# EAGLE schematic JugendLichtSteuerung (EAGLE 7.2.0)
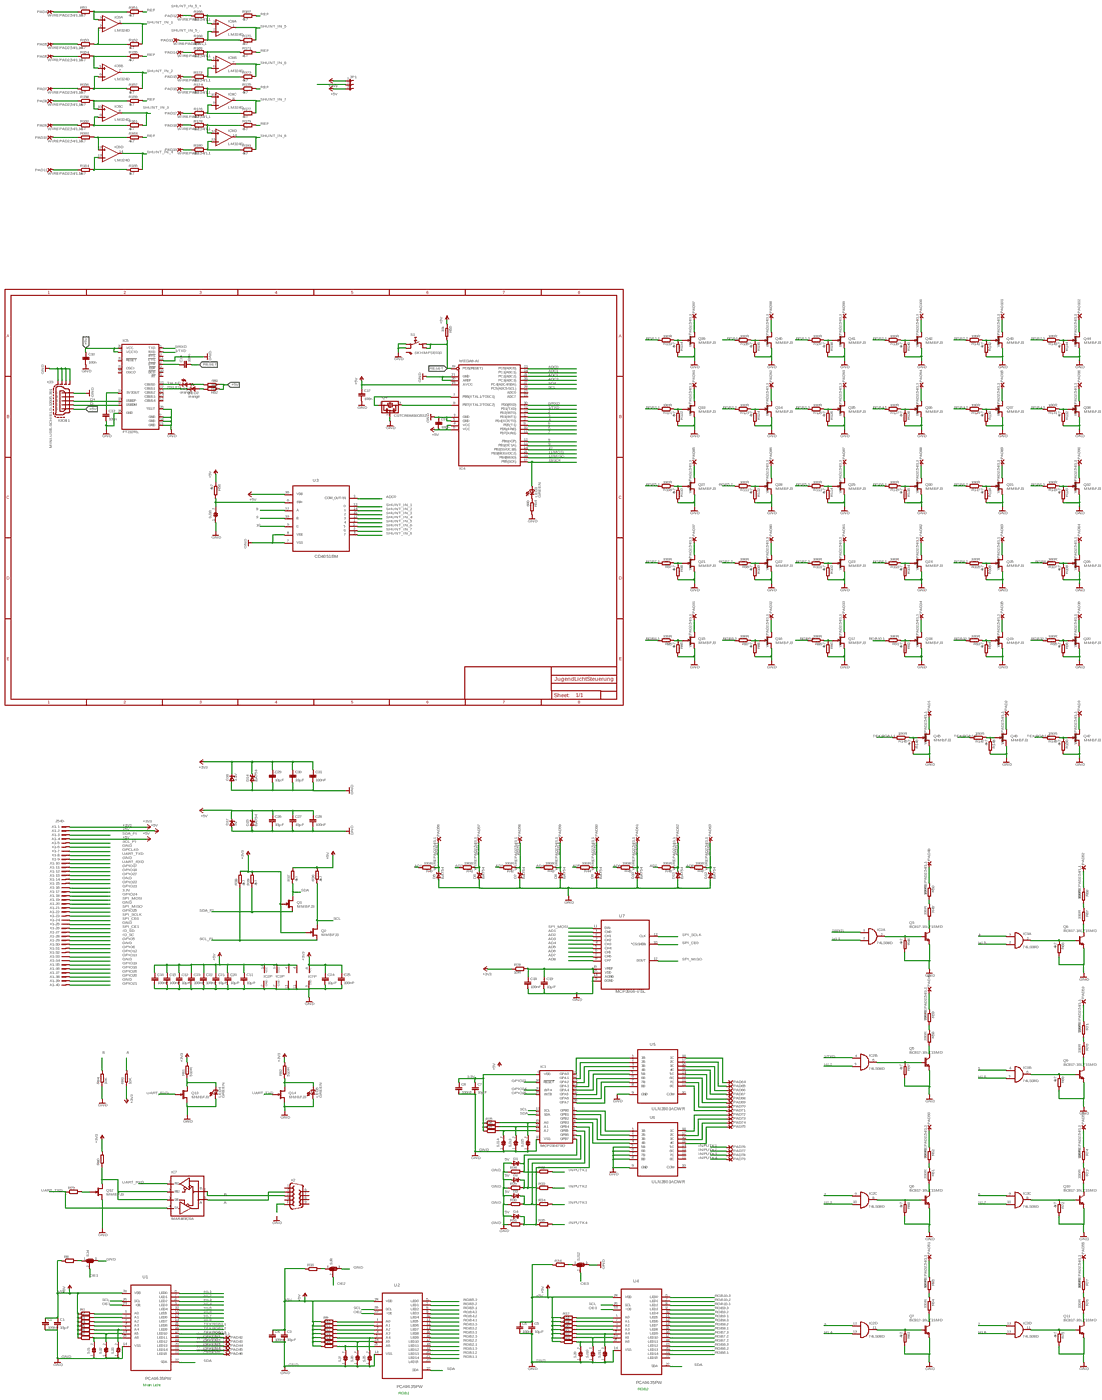
[diagram p0: schematic, sheet 1, overview]
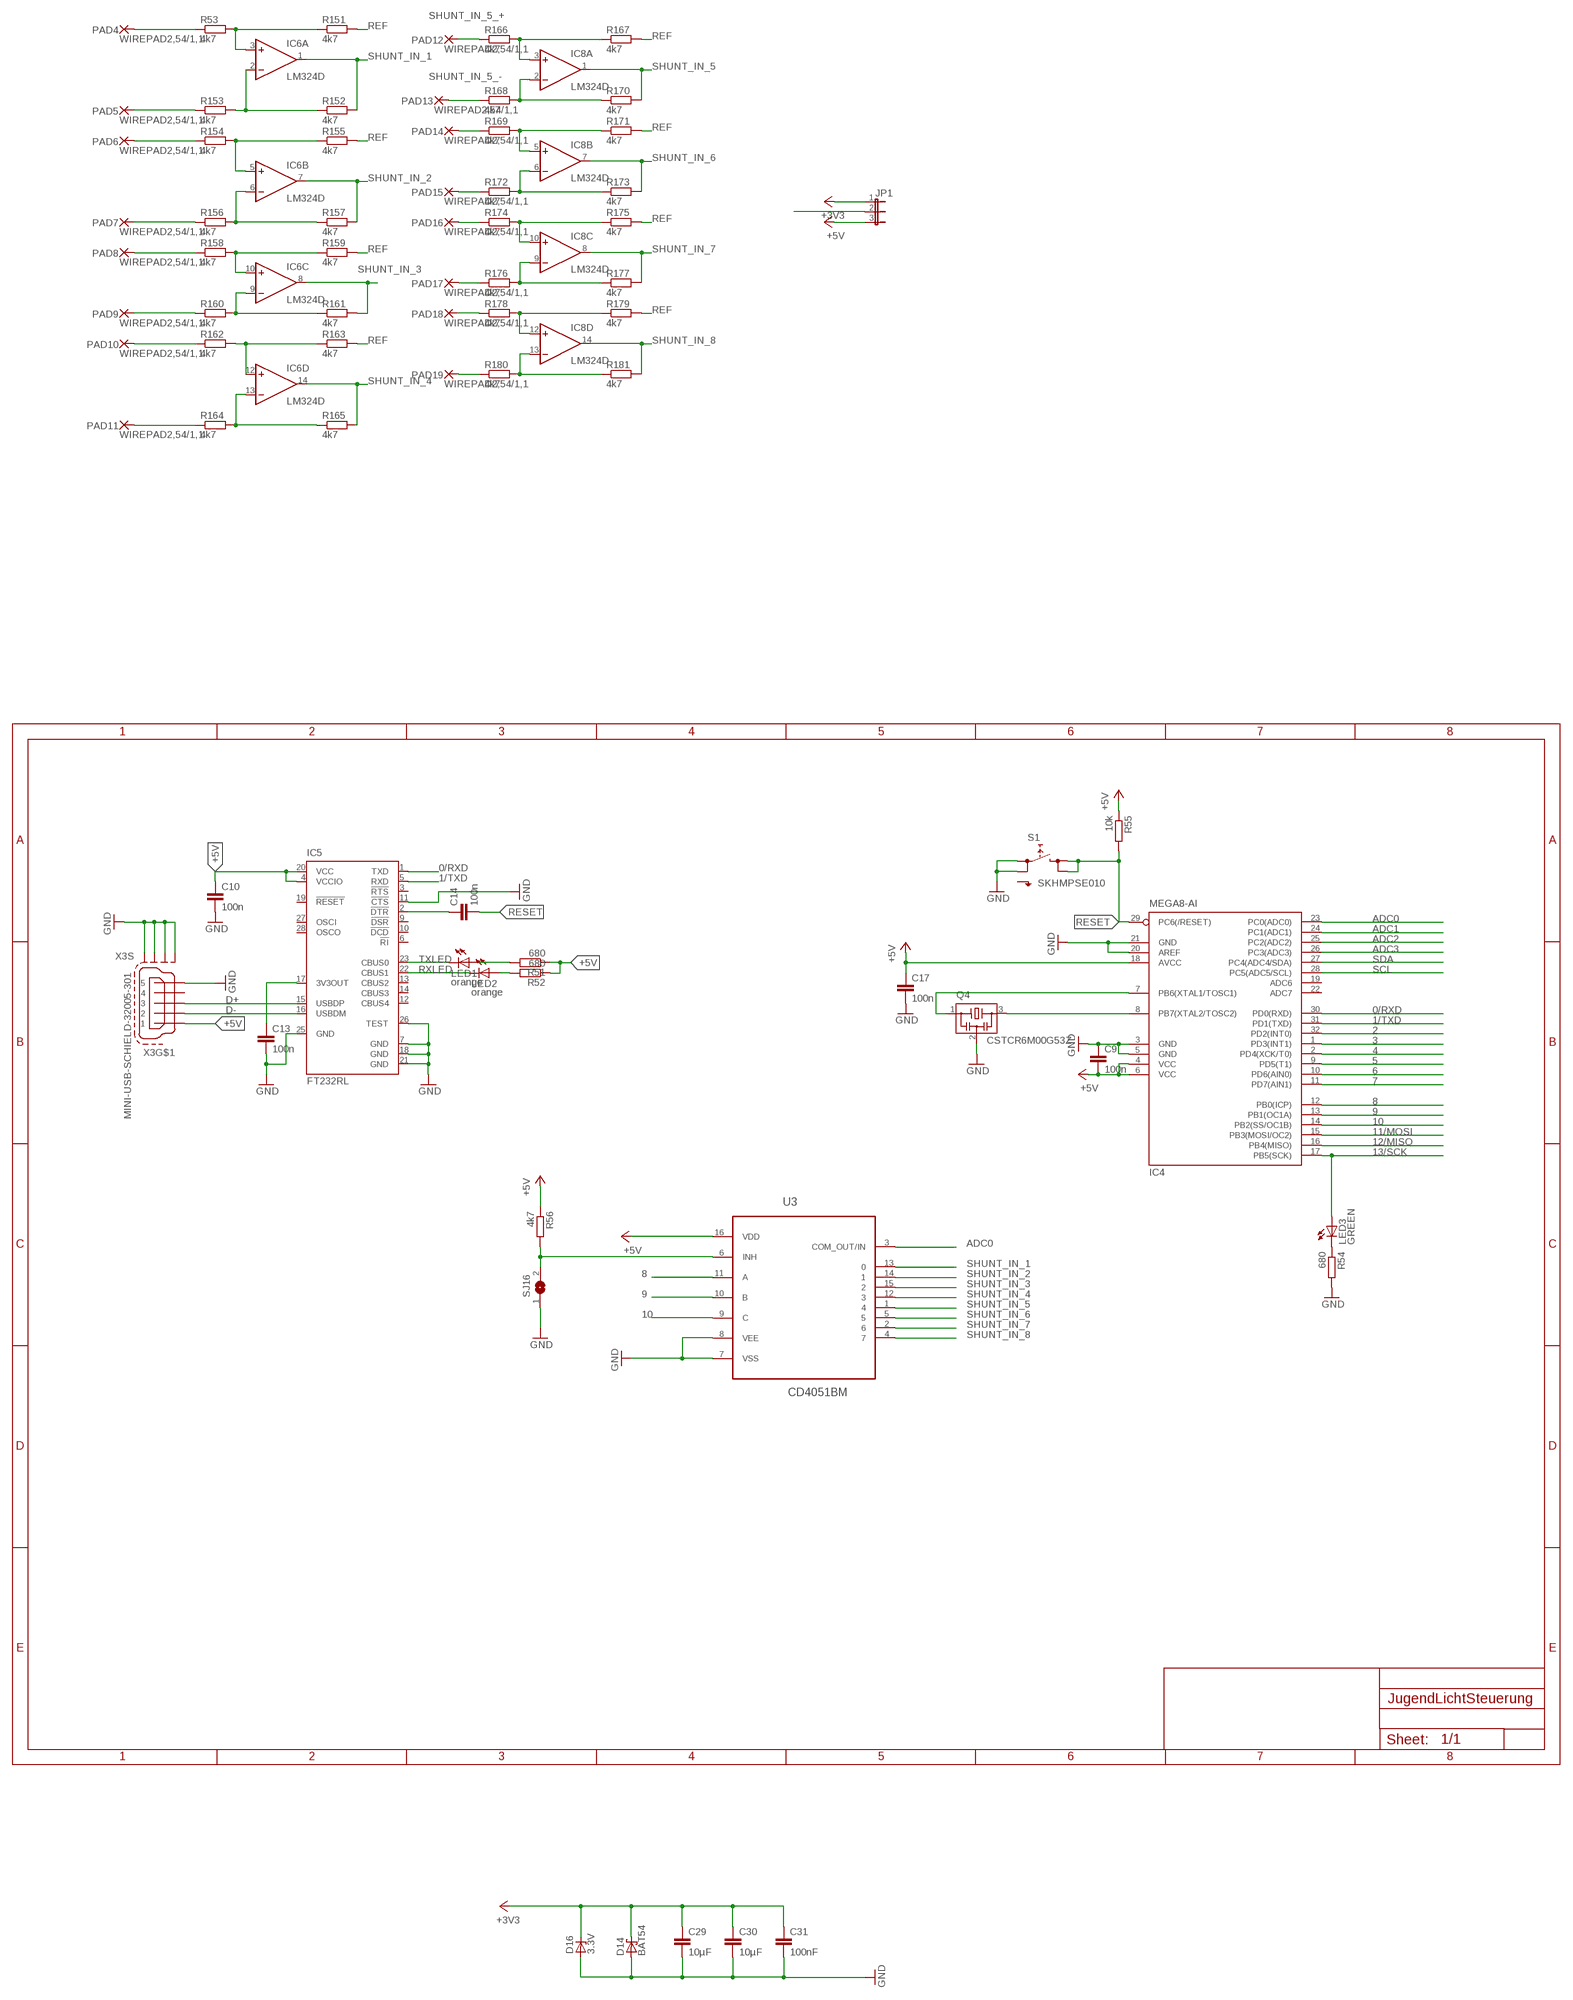
[diagram p1: schematic, sheet 1, part 1 of 4]
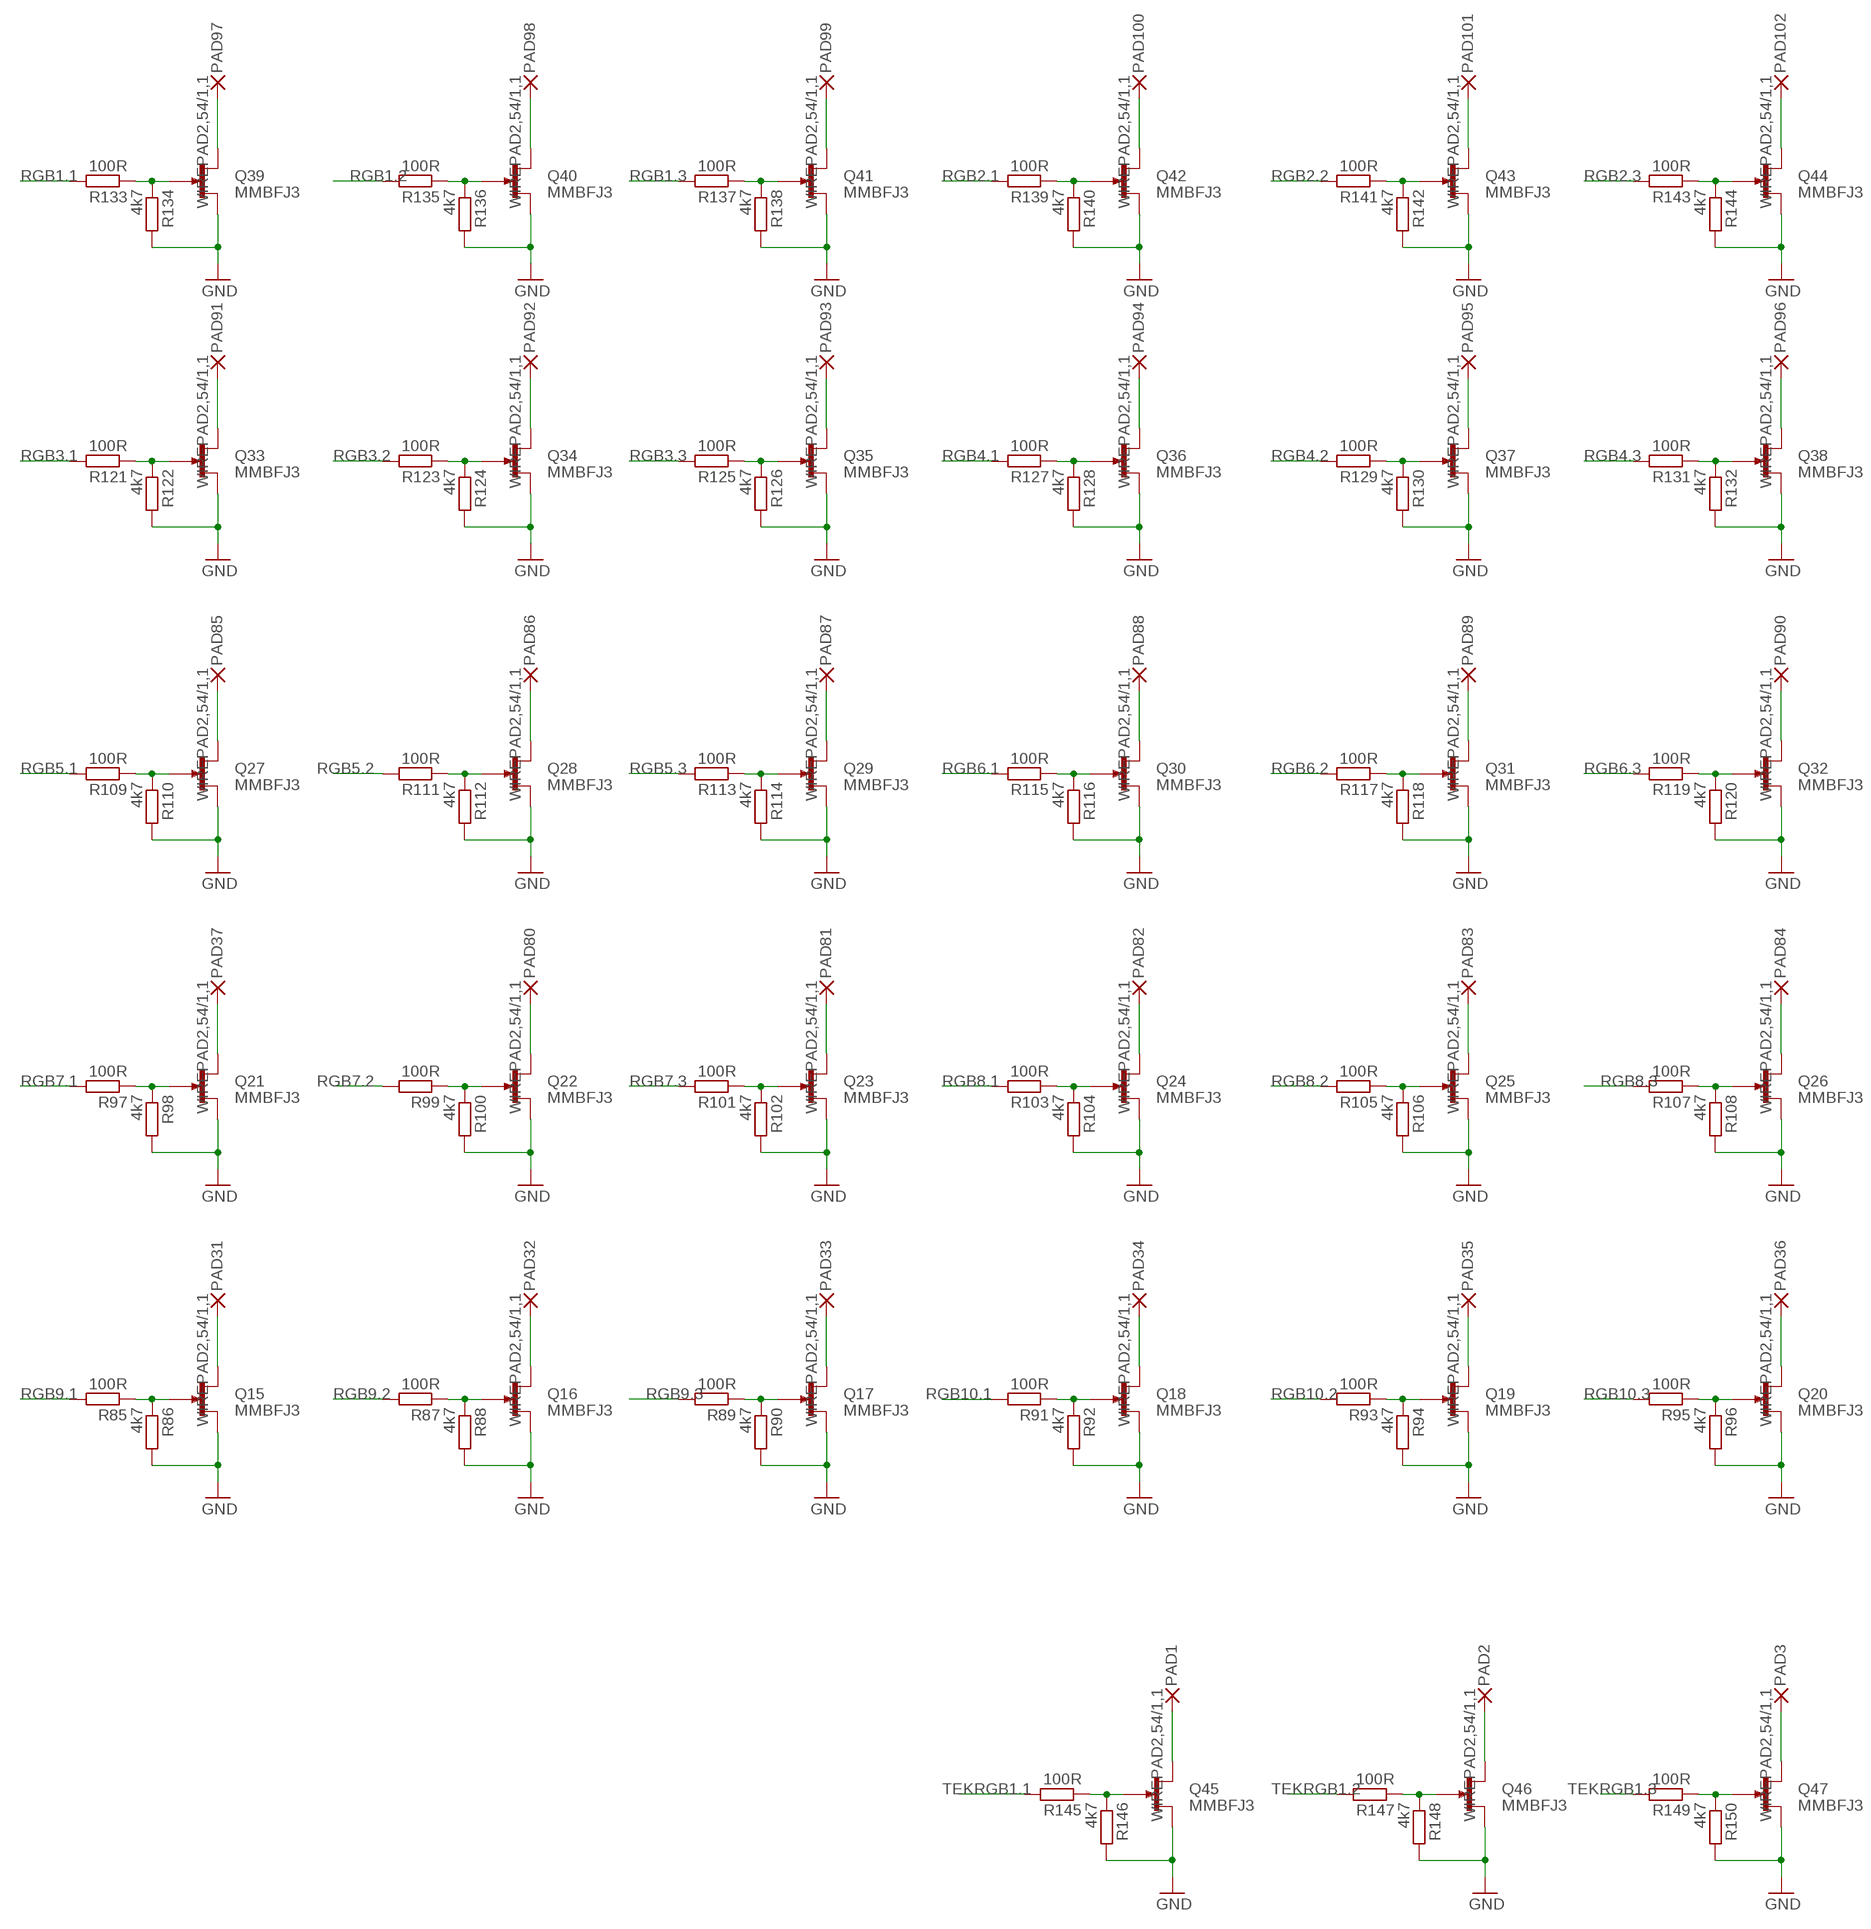
[diagram p2: schematic, sheet 1, part 2 of 4]
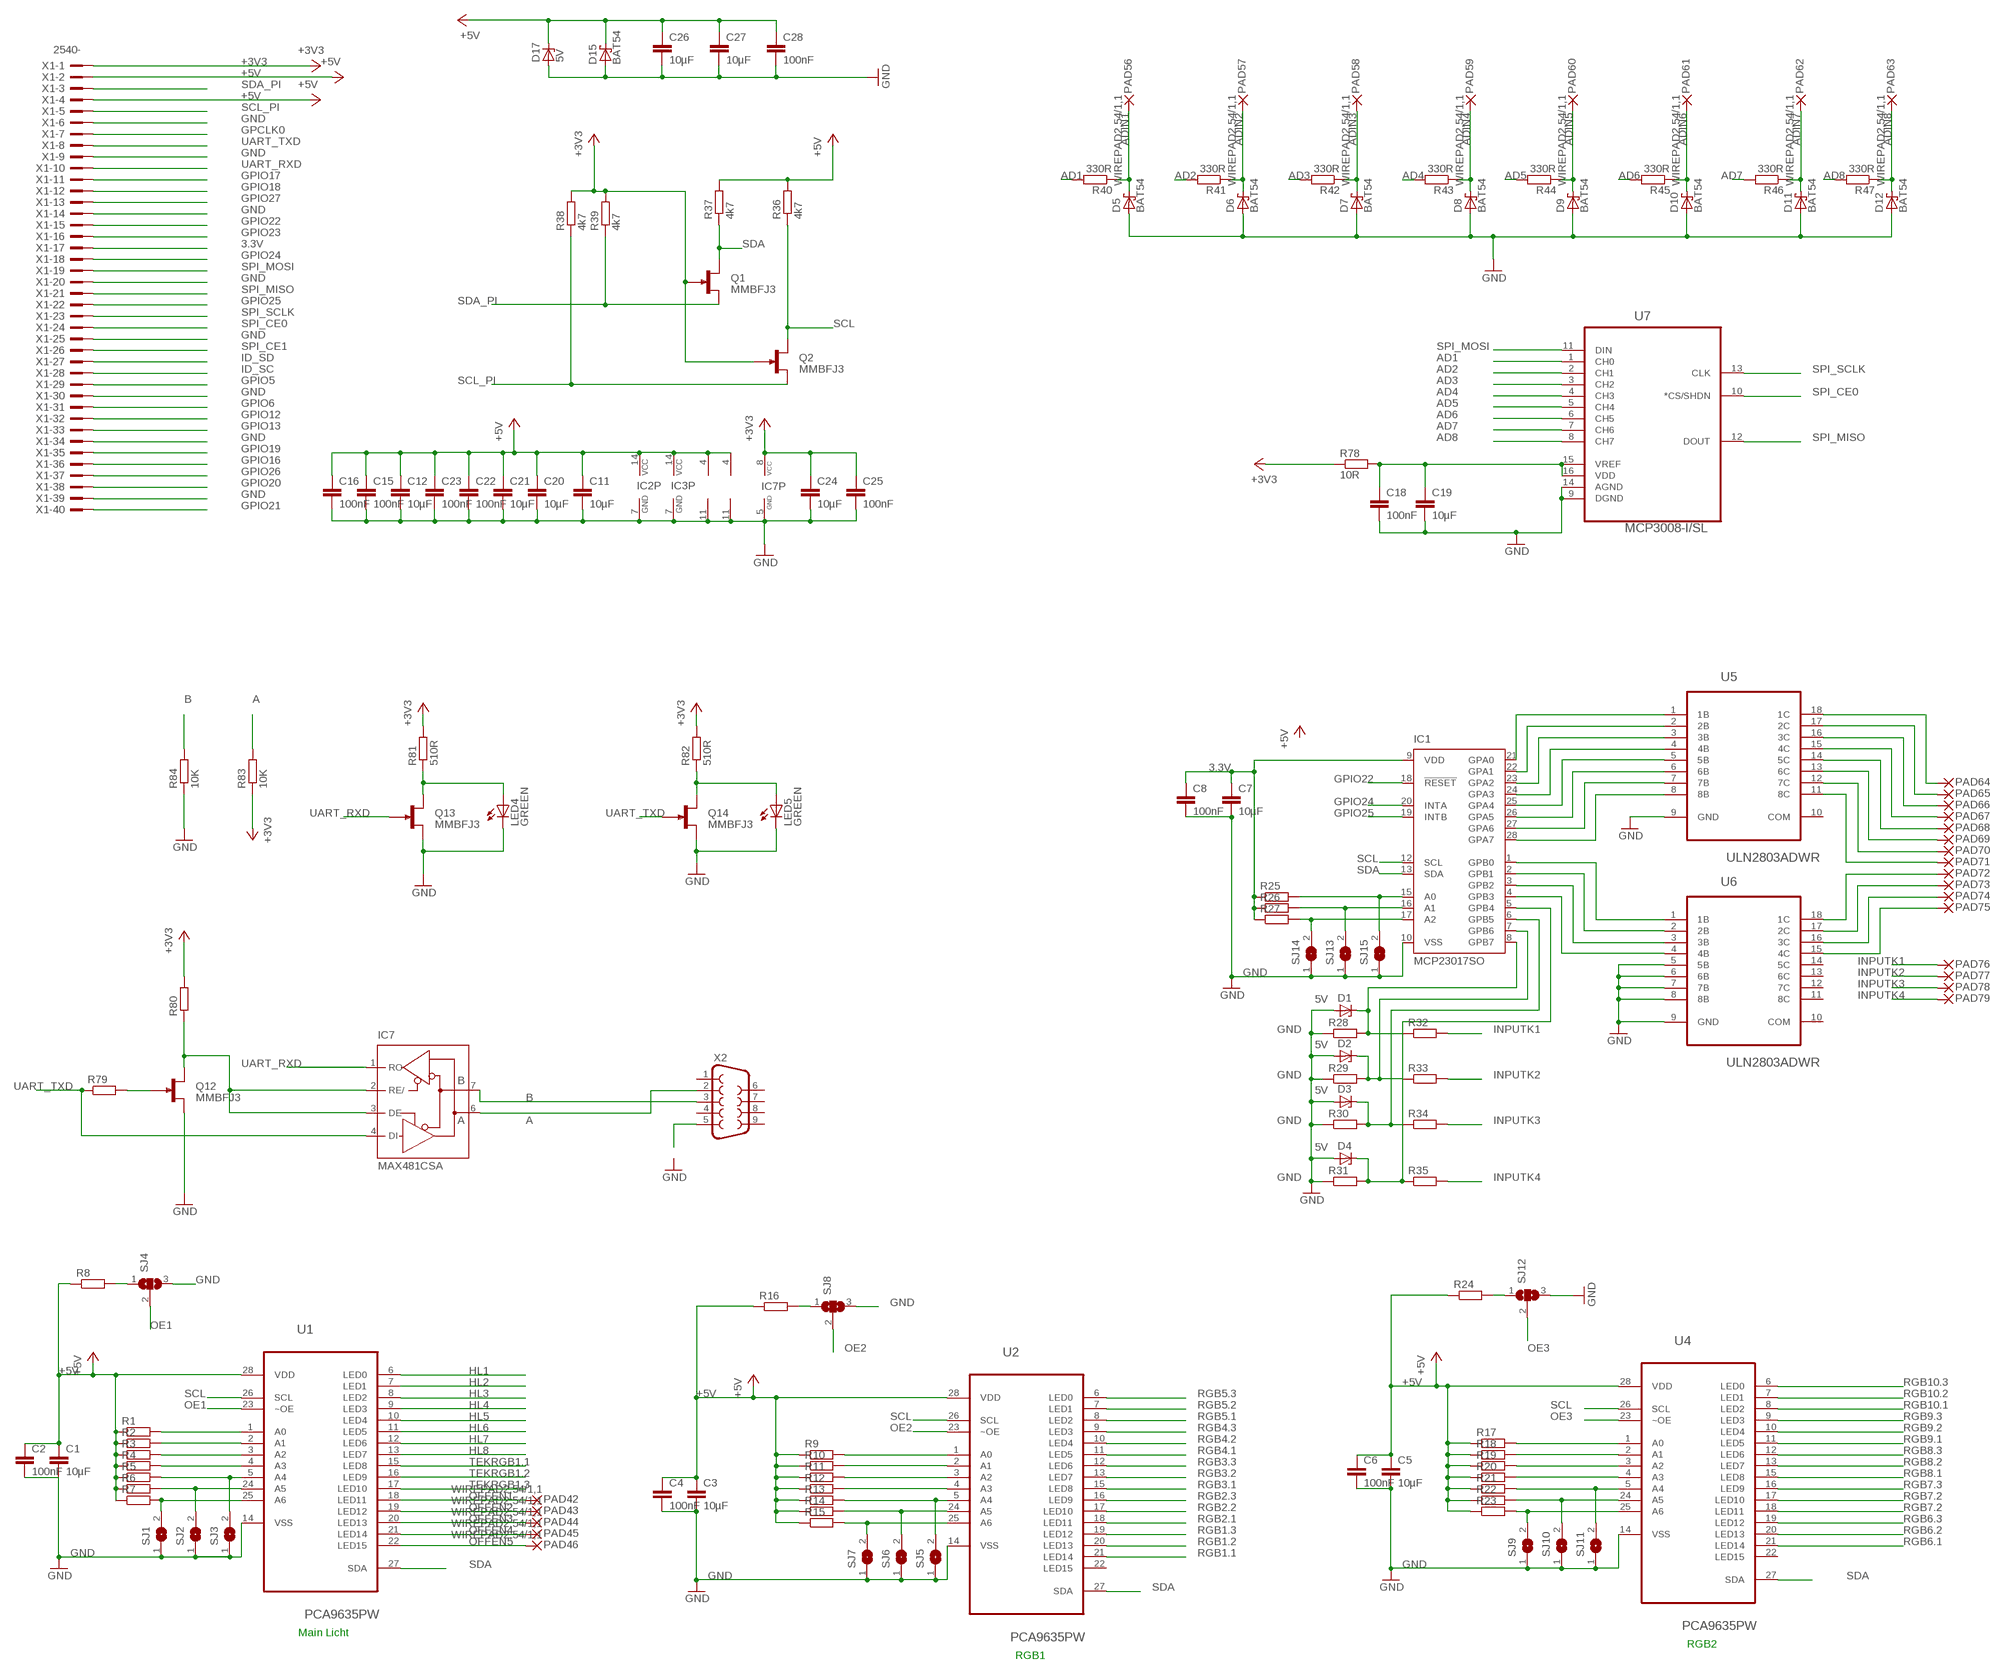
[diagram p3: schematic, sheet 1, part 3 of 4]
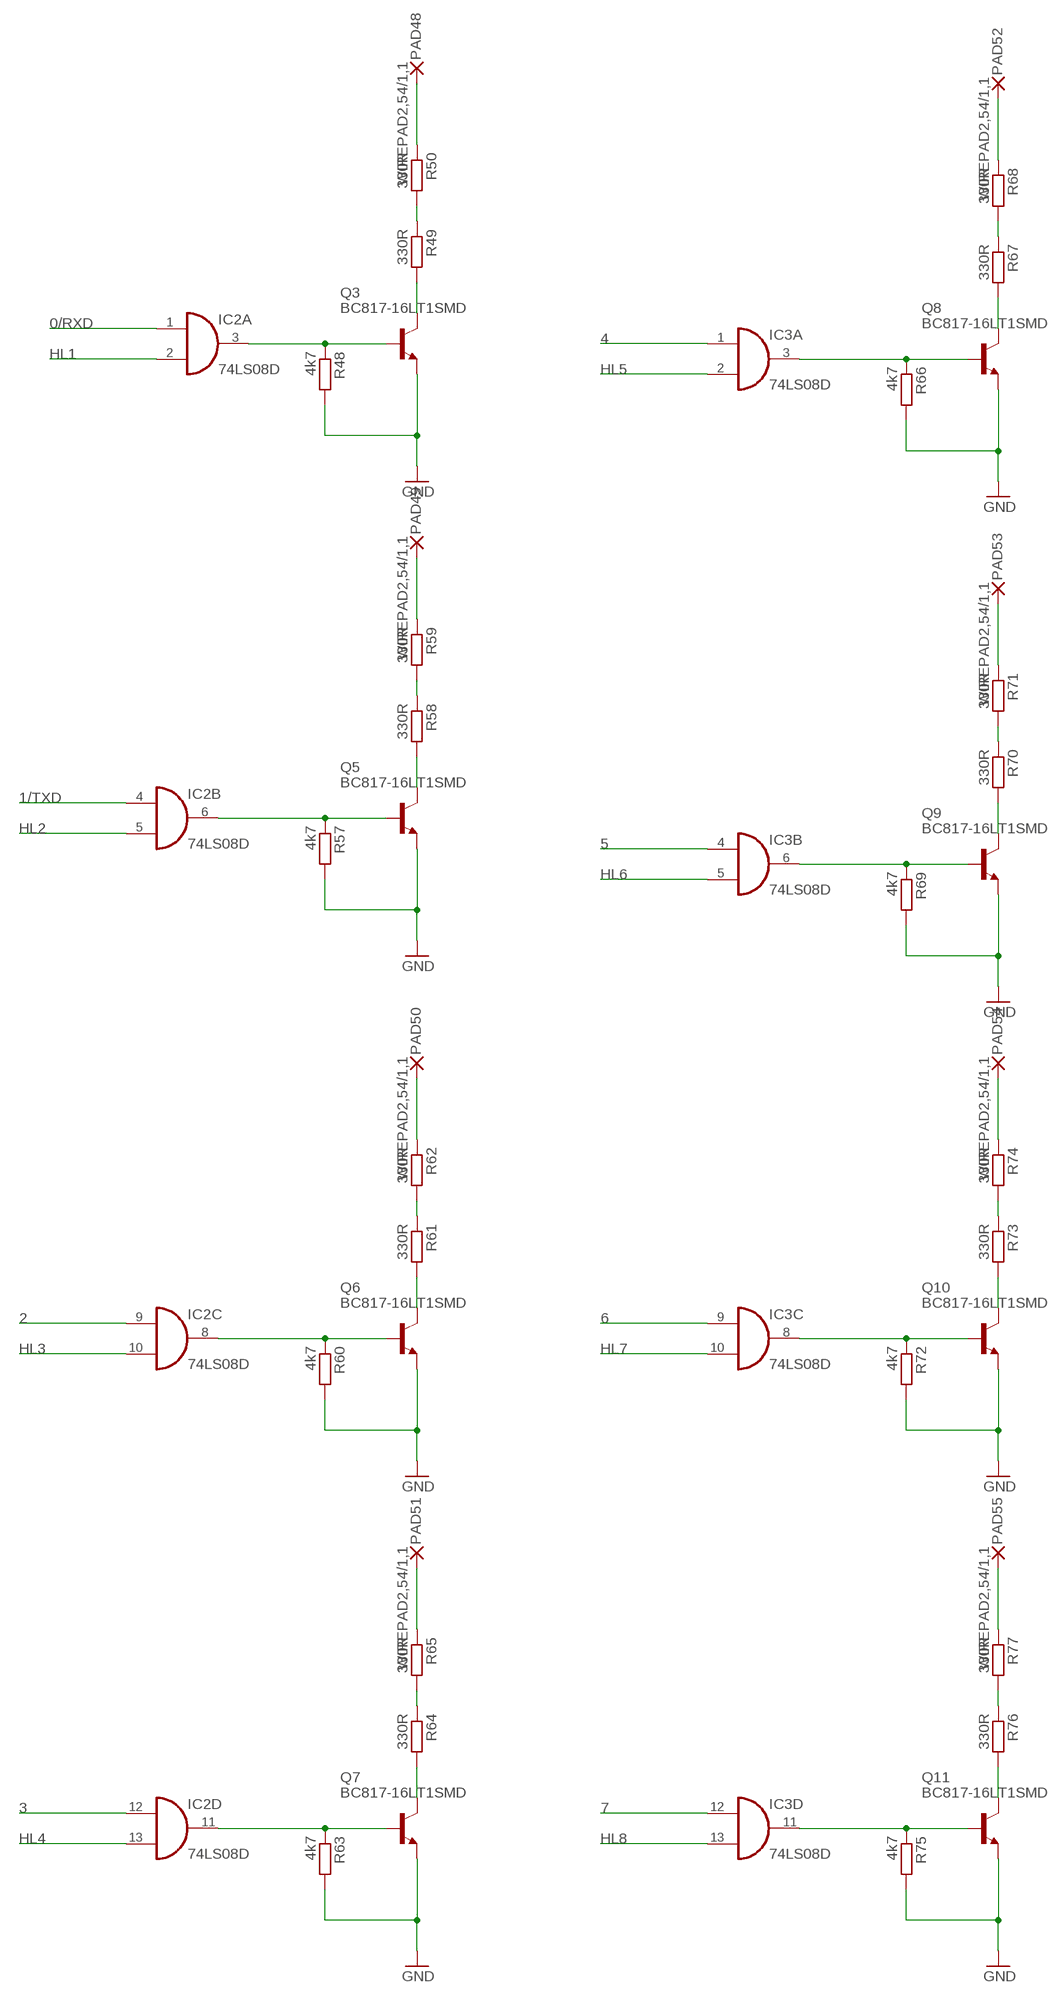
[diagram p4: schematic, sheet 1, part 4 of 4]

## Parts
C1  10µF  C-EUC0805  [C0805]
C2  100nF  C-EUC0805  [C0805]
C3  10µF  C-EUC0805  [C0805]
C4  100nF  C-EUC0805  [C0805]
C5  10µF  C-EUC0805  [C0805]
C6  100nF  C-EUC0805  [C0805]
C7  10µF  C-EUC0805  [C0805]
C8  100nF  C-EUC0805  [C0805]
C9  100n  C-EUC0603  [C0603]
C10  100n  C-EUC0603  [C0603]
C11  10µF  C-EUC0805  [C0805]
C12  10µF  C-EUC0805  [C0805]
C13  100n  C-EUC1206K  [C1206K]
C14  100n  C-EUC0603  [C0603]
C15  100nF  C-EUC0805  [C0805]
C16  100nF  C-EUC0805  [C0805]
C17  100n  C-EUC0603K  [C0603K]
C18  100nF  C-EUC0805  [C0805]
C19  10µF  C-EUC0805  [C0805]
C20  10µF  C-EUC0805  [C0805]
C21  10µF  C-EUC0805  [C0805]
C22  100nF  C-EUC0805  [C0805]
C23  100nF  C-EUC0805  [C0805]
C24  10µF  C-EUC0805  [C0805]
C25  100nF  C-EUC0805  [C0805]
C26  10µF  C-EUC0805  [C0805]
C27  10µF  C-EUC0805  [C0805]
C28  100nF  C-EUC0805  [C0805]
C29  10µF  C-EUC0805  [C0805]
C30  10µF  C-EUC0805  [C0805]
C31  100nF  C-EUC0805  [C0805]
D1  5V  ZENER-DIODESOD80C  [SOD80C]
D2  5V  ZENER-DIODESOD80C  [SOD80C]
D3  5V  ZENER-DIODESOD80C  [SOD80C]
D4  5V  ZENER-DIODESOD80C  [SOD80C]
D5  BAT54  [SOT23]
D6  BAT54  [SOT23]
D7  BAT54  [SOT23]
D8  BAT54  [SOT23]
D9  BAT54  [SOT23]
D10  BAT54  [SOT23]
D11  BAT54  [SOT23]
D12  BAT54  [SOT23]
D14  BAT54  [SOT23]
D15  BAT54  [SOT23]
D16  3.3V  ZENER-DIODESOD80C  [SOD80C]
D17  5V  ZENER-DIODESOD80C  [SOD80C]
IC1  MCP23017SO  [SO28W]
IC2  74LS08D  [SO14]
IC3  74LS08D  [SO14]
IC4  MEGA8-AI  [TQFP32-08]
IC5  FT232RL  [SSOP28]
IC6  LM324D  [SO14]
IC7  MAX481CSA  [SO08]
IC8  LM324D  [SO14]
JP1  JP2E  [JP2]
LED1  orange  LEDCHIPLED_1206  [CHIPLED_1206]
LED2  orange  LEDCHIPLED_1206  [CHIPLED_1206]
LED3  GREEN  LEDCHIPLED_1206  [CHIPLED_1206]
LED4  GREEN  LEDCHIPLED_1206  [CHIPLED_1206]
LED5  GREEN  LEDCHIPLED_1206  [CHIPLED_1206]
PAD1  WIREPAD2,54/1,1  [2,54/1,1]
PAD2  WIREPAD2,54/1,1  [2,54/1,1]
PAD3  WIREPAD2,54/1,1  [2,54/1,1]
PAD4  WIREPAD2,54/1,1  [2,54/1,1]
PAD5  WIREPAD2,54/1,1  [2,54/1,1]
PAD6  WIREPAD2,54/1,1  [2,54/1,1]
PAD7  WIREPAD2,54/1,1  [2,54/1,1]
PAD8  WIREPAD2,54/1,1  [2,54/1,1]
PAD9  WIREPAD2,54/1,1  [2,54/1,1]
PAD10  WIREPAD2,54/1,1  [2,54/1,1]
PAD11  WIREPAD2,54/1,1  [2,54/1,1]
PAD12  WIREPAD2,54/1,1  [2,54/1,1]
PAD13  WIREPAD2,54/1,1  [2,54/1,1]
PAD14  WIREPAD2,54/1,1  [2,54/1,1]
PAD15  WIREPAD2,54/1,1  [2,54/1,1]
PAD16  WIREPAD2,54/1,1  [2,54/1,1]
PAD17  WIREPAD2,54/1,1  [2,54/1,1]
PAD18  WIREPAD2,54/1,1  [2,54/1,1]
PAD19  WIREPAD2,54/1,1  [2,54/1,1]
PAD31  WIREPAD2,54/1,1  [2,54/1,1]
PAD32  WIREPAD2,54/1,1  [2,54/1,1]
PAD33  WIREPAD2,54/1,1  [2,54/1,1]
PAD34  WIREPAD2,54/1,1  [2,54/1,1]
PAD35  WIREPAD2,54/1,1  [2,54/1,1]
PAD36  WIREPAD2,54/1,1  [2,54/1,1]
PAD37  WIREPAD2,54/1,1  [2,54/1,1]
PAD42  WIREPAD2,54/1,1  [2,54/1,1]
PAD43  WIREPAD2,54/1,1  [2,54/1,1]
PAD44  WIREPAD2,54/1,1  [2,54/1,1]
PAD45  WIREPAD2,54/1,1  [2,54/1,1]
PAD46  WIREPAD2,54/1,1  [2,54/1,1]
PAD48  WIREPAD2,54/1,1  [2,54/1,1]
PAD49  WIREPAD2,54/1,1  [2,54/1,1]
PAD50  WIREPAD2,54/1,1  [2,54/1,1]
PAD51  WIREPAD2,54/1,1  [2,54/1,1]
PAD52  WIREPAD2,54/1,1  [2,54/1,1]
PAD53  WIREPAD2,54/1,1  [2,54/1,1]
PAD54  WIREPAD2,54/1,1  [2,54/1,1]
PAD55  WIREPAD2,54/1,1  [2,54/1,1]
PAD56  WIREPAD2,54/1,1  [2,54/1,1]
PAD57  WIREPAD2,54/1,1  [2,54/1,1]
PAD58  WIREPAD2,54/1,1  [2,54/1,1]
PAD59  WIREPAD2,54/1,1  [2,54/1,1]
PAD60  WIREPAD2,54/1,1  [2,54/1,1]
PAD61  WIREPAD2,54/1,1  [2,54/1,1]
PAD62  WIREPAD2,54/1,1  [2,54/1,1]
PAD63  WIREPAD2,54/1,1  [2,54/1,1]
PAD64  3,81/1,4  [3,81/1,4]
PAD65  3,81/1,4  [3,81/1,4]
PAD66  3,81/1,4  [3,81/1,4]
PAD67  3,81/1,4  [3,81/1,4]
PAD68  3,81/1,4  [3,81/1,4]
PAD69  3,81/1,4  [3,81/1,4]
PAD70  3,81/1,4  [3,81/1,4]
PAD71  3,81/1,4  [3,81/1,4]
PAD72  3,81/1,4  [3,81/1,4]
PAD73  3,81/1,4  [3,81/1,4]
PAD74  3,81/1,4  [3,81/1,4]
PAD75  3,81/1,4  [3,81/1,4]
PAD76  3,81/1,4  [3,81/1,4]
PAD77  3,81/1,4  [3,81/1,4]
PAD78  3,81/1,4  [3,81/1,4]
PAD79  3,81/1,4  [3,81/1,4]
PAD80  WIREPAD2,54/1,1  [2,54/1,1]
PAD81  WIREPAD2,54/1,1  [2,54/1,1]
PAD82  WIREPAD2,54/1,1  [2,54/1,1]
PAD83  WIREPAD2,54/1,1  [2,54/1,1]
PAD84  WIREPAD2,54/1,1  [2,54/1,1]
PAD85  WIREPAD2,54/1,1  [2,54/1,1]
PAD86  WIREPAD2,54/1,1  [2,54/1,1]
PAD87  WIREPAD2,54/1,1  [2,54/1,1]
PAD88  WIREPAD2,54/1,1  [2,54/1,1]
PAD89  WIREPAD2,54/1,1  [2,54/1,1]
PAD90  WIREPAD2,54/1,1  [2,54/1,1]
PAD91  WIREPAD2,54/1,1  [2,54/1,1]
PAD92  WIREPAD2,54/1,1  [2,54/1,1]
PAD93  WIREPAD2,54/1,1  [2,54/1,1]
PAD94  WIREPAD2,54/1,1  [2,54/1,1]
PAD95  WIREPAD2,54/1,1  [2,54/1,1]
PAD96  WIREPAD2,54/1,1  [2,54/1,1]
PAD97  WIREPAD2,54/1,1  [2,54/1,1]
PAD98  WIREPAD2,54/1,1  [2,54/1,1]
PAD99  WIREPAD2,54/1,1  [2,54/1,1]
PAD100  WIREPAD2,54/1,1  [2,54/1,1]
PAD101  WIREPAD2,54/1,1  [2,54/1,1]
PAD102  WIREPAD2,54/1,1  [2,54/1,1]
Q1  MMBFJ3  [SOT23]
Q2  MMBFJ3  [SOT23]
Q3  BC817-16LT1SMD  [SOT23-BEC]
Q4  CSTCR6M00G53Z  [CSTCR6M]
Q5  BC817-16LT1SMD  [SOT23-BEC]
Q6  BC817-16LT1SMD  [SOT23-BEC]
Q7  BC817-16LT1SMD  [SOT23-BEC]
Q8  BC817-16LT1SMD  [SOT23-BEC]
Q9  BC817-16LT1SMD  [SOT23-BEC]
Q10  BC817-16LT1SMD  [SOT23-BEC]
Q11  BC817-16LT1SMD  [SOT23-BEC]
Q12  MMBFJ3  [SOT23]
Q13  MMBFJ3  [SOT23]
Q14  MMBFJ3  [SOT23]
Q15  MMBFJ3  [SOT23]
Q16  MMBFJ3  [SOT23]
Q17  MMBFJ3  [SOT23]
Q18  MMBFJ3  [SOT23]
Q19  MMBFJ3  [SOT23]
Q20  MMBFJ3  [SOT23]
Q21  MMBFJ3  [SOT23]
Q22  MMBFJ3  [SOT23]
Q23  MMBFJ3  [SOT23]
Q24  MMBFJ3  [SOT23]
Q25  MMBFJ3  [SOT23]
Q26  MMBFJ3  [SOT23]
Q27  MMBFJ3  [SOT23]
Q28  MMBFJ3  [SOT23]
Q29  MMBFJ3  [SOT23]
Q30  MMBFJ3  [SOT23]
Q31  MMBFJ3  [SOT23]
Q32  MMBFJ3  [SOT23]
Q33  MMBFJ3  [SOT23]
Q34  MMBFJ3  [SOT23]
Q35  MMBFJ3  [SOT23]
Q36  MMBFJ3  [SOT23]
Q37  MMBFJ3  [SOT23]
Q38  MMBFJ3  [SOT23]
Q39  MMBFJ3  [SOT23]
Q40  MMBFJ3  [SOT23]
Q41  MMBFJ3  [SOT23]
Q42  MMBFJ3  [SOT23]
Q43  MMBFJ3  [SOT23]
Q44  MMBFJ3  [SOT23]
Q45  MMBFJ3  [SOT23]
Q46  MMBFJ3  [SOT23]
Q47  MMBFJ3  [SOT23]
R1  R-EU_R0603  [R0603]
R2  R-EU_R0603  [R0603]
R3  R-EU_R0603  [R0603]
R4  R-EU_R0603  [R0603]
R5  R-EU_R0603  [R0603]
R6  R-EU_R0603  [R0603]
R7  R-EU_R0603  [R0603]
R8  R-EU_R0603  [R0603]
R9  R-EU_R0603  [R0603]
R10  R-EU_R0603  [R0603]
R11  R-EU_R0603  [R0603]
R12  R-EU_R0603  [R0603]
R13  R-EU_R0603  [R0603]
R14  R-EU_R0603  [R0603]
R15  R-EU_R0603  [R0603]
R16  R-EU_R0603  [R0603]
R17  R-EU_R0603  [R0603]
R18  R-EU_R0603  [R0603]
R19  R-EU_R0603  [R0603]
R20  R-EU_R0603  [R0603]
R21  R-EU_R0603  [R0603]
R22  R-EU_R0603  [R0603]
R23  R-EU_R0603  [R0603]
R24  R-EU_R0603  [R0603]
R25  R-EU_R0603  [R0603]
R26  R-EU_R0603  [R0603]
R27  R-EU_R0603  [R0603]
R28  R-EU_R0603  [R0603]
R29  R-EU_R0603  [R0603]
R30  R-EU_R0603  [R0603]
R31  R-EU_R0603  [R0603]
R32  R-EU_R0603  [R0603]
R33  R-EU_R0603  [R0603]
R34  R-EU_R0603  [R0603]
R35  R-EU_R0603  [R0603]
R36  4k7  R-EU_R0603  [R0603]
R37  4k7  R-EU_R0603  [R0603]
R38  4k7  R-EU_R0603  [R0603]
R39  4k7  R-EU_R0603  [R0603]
R40  330R  R-EU_R0603  [R0603]
R41  330R  R-EU_R0603  [R0603]
R42  330R  R-EU_R0603  [R0603]
R43  330R  R-EU_R0603  [R0603]
R44  330R  R-EU_R0603  [R0603]
R45  330R  R-EU_R0603  [R0603]
R46  330R  R-EU_R0603  [R0603]
R47  330R  R-EU_R0603  [R0603]
R48  4k7  R-EU_R0603  [R0603]
R49  330R  R-EU_R0603  [R0603]
R50  330R  R-EU_R0603  [R0603]
R51  680  R-EU_R0603  [R0603]
R52  680  R-EU_R0603  [R0603]
R53  4k7  R-EU_R0603  [R0603]
R54  680  R-EU_R0603  [R0603]
R55  10k  R-EU_R0603  [R0603]
R56  4k7  R-EU_R0603  [R0603]
R57  4k7  R-EU_R0603  [R0603]
R58  330R  R-EU_R0603  [R0603]
R59  330R  R-EU_R0603  [R0603]
R60  4k7  R-EU_R0603  [R0603]
R61  330R  R-EU_R0603  [R0603]
R62  330R  R-EU_R0603  [R0603]
R63  4k7  R-EU_R0603  [R0603]
R64  330R  R-EU_R0603  [R0603]
R65  330R  R-EU_R0603  [R0603]
R66  4k7  R-EU_R0603  [R0603]
R67  330R  R-EU_R0603  [R0603]
R68  330R  R-EU_R0603  [R0603]
R69  4k7  R-EU_R0603  [R0603]
R70  330R  R-EU_R0603  [R0603]
R71  330R  R-EU_R0603  [R0603]
R72  4k7  R-EU_R0603  [R0603]
R73  330R  R-EU_R0603  [R0603]
R74  330R  R-EU_R0603  [R0603]
R75  4k7  R-EU_R0603  [R0603]
R76  330R  R-EU_R0603  [R0603]
R77  330R  R-EU_R0603  [R0603]
R78  10R  R-EU_R0603  [R0603]
R79  R-EU_R0603  [R0603]
R80  R-EU_R0603  [R0603]
R81  510R  R-EU_R0603  [R0603]
R82  510R  R-EU_R0603  [R0603]
R83  10K  R-EU_R0603  [R0603]
R84  10K  R-EU_R0603  [R0603]
R85  100R  R-EU_R0603  [R0603]
R86  4k7  R-EU_R0603  [R0603]
R87  100R  R-EU_R0603  [R0603]
R88  4k7  R-EU_R0603  [R0603]
R89  100R  R-EU_R0603  [R0603]
R90  4k7  R-EU_R0603  [R0603]
R91  100R  R-EU_R0603  [R0603]
R92  4k7  R-EU_R0603  [R0603]
R93  100R  R-EU_R0603  [R0603]
R94  4k7  R-EU_R0603  [R0603]
R95  100R  R-EU_R0603  [R0603]
R96  4k7  R-EU_R0603  [R0603]
R97  100R  R-EU_R0603  [R0603]
R98  4k7  R-EU_R0603  [R0603]
R99  100R  R-EU_R0603  [R0603]
R100  4k7  R-EU_R0603  [R0603]
R101  100R  R-EU_R0603  [R0603]
R102  4k7  R-EU_R0603  [R0603]
R103  100R  R-EU_R0603  [R0603]
R104  4k7  R-EU_R0603  [R0603]
R105  100R  R-EU_R0603  [R0603]
R106  4k7  R-EU_R0603  [R0603]
R107  100R  R-EU_R0603  [R0603]
R108  4k7  R-EU_R0603  [R0603]
R109  100R  R-EU_R0603  [R0603]
R110  4k7  R-EU_R0603  [R0603]
R111  100R  R-EU_R0603  [R0603]
R112  4k7  R-EU_R0603  [R0603]
R113  100R  R-EU_R0603  [R0603]
R114  4k7  R-EU_R0603  [R0603]
R115  100R  R-EU_R0603  [R0603]
R116  4k7  R-EU_R0603  [R0603]
R117  100R  R-EU_R0603  [R0603]
R118  4k7  R-EU_R0603  [R0603]
R119  100R  R-EU_R0603  [R0603]
R120  4k7  R-EU_R0603  [R0603]
R121  100R  R-EU_R0603  [R0603]
R122  4k7  R-EU_R0603  [R0603]
R123  100R  R-EU_R0603  [R0603]
R124  4k7  R-EU_R0603  [R0603]
R125  100R  R-EU_R0603  [R0603]
R126  4k7  R-EU_R0603  [R0603]
R127  100R  R-EU_R0603  [R0603]
R128  4k7  R-EU_R0603  [R0603]
R129  100R  R-EU_R0603  [R0603]
R130  4k7  R-EU_R0603  [R0603]
R131  100R  R-EU_R0603  [R0603]
R132  4k7  R-EU_R0603  [R0603]
R133  100R  R-EU_R0603  [R0603]
R134  4k7  R-EU_R0603  [R0603]
R135  100R  R-EU_R0603  [R0603]
R136  4k7  R-EU_R0603  [R0603]
R137  100R  R-EU_R0603  [R0603]
R138  4k7  R-EU_R0603  [R0603]
R139  100R  R-EU_R0603  [R0603]
R140  4k7  R-EU_R0603  [R0603]
R141  100R  R-EU_R0603  [R0603]
R142  4k7  R-EU_R0603  [R0603]
R143  100R  R-EU_R0603  [R0603]
R144  4k7  R-EU_R0603  [R0603]
R145  100R  R-EU_R0603  [R0603]
R146  4k7  R-EU_R0603  [R0603]
R147  100R  R-EU_R0603  [R0603]
R148  4k7  R-EU_R0603  [R0603]
R149  100R  R-EU_R0603  [R0603]
R150  4k7  R-EU_R0603  [R0603]
R151  4k7  R-EU_R0603  [R0603]
R152  4k7  R-EU_R0603  [R0603]
R153  4k7  R-EU_R0603  [R0603]
R154  4k7  R-EU_R0603  [R0603]
R155  4k7  R-EU_R0603  [R0603]
R156  4k7  R-EU_R0603  [R0603]
R157  4k7  R-EU_R0603  [R0603]
R158  4k7  R-EU_R0603  [R0603]
R159  4k7  R-EU_R0603  [R0603]
R160  4k7  R-EU_R0603  [R0603]
R161  4k7  R-EU_R0603  [R0603]
R162  4k7  R-EU_R0603  [R0603]
R163  4k7  R-EU_R0805  [R0805]
R164  4k7  R-EU_R0603  [R0603]
R165  4k7  R-EU_R0603  [R0603]
R166  4k7  R-EU_R0603  [R0603]
R167  4k7  R-EU_R0603  [R0603]
R168  4k7  R-EU_R0603  [R0603]
R169  4k7  R-EU_R0603  [R0603]
R170  4k7  R-EU_R0603  [R0603]
R171  4k7  R-EU_R0603  [R0603]
R172  4k7  R-EU_R0603  [R0603]
R173  4k7  R-EU_R0603  [R0603]
R174  4k7  R-EU_R0603  [R0603]
R175  4k7  R-EU_R0603  [R0603]
R176  4k7  R-EU_R0603  [R0603]
R177  4k7  R-EU_R0603  [R0603]
R178  4k7  R-EU_R0603  [R0603]
R179  4k7  R-EU_R0603  [R0603]
R180  4k7  R-EU_R0603  [R0603]
R181  4k7  R-EU_R0603  [R0603]
S1  SKHMPSE010  [SKHMPXE010]
SJ1  SJ  [SJ]
SJ2  SJ  [SJ]
SJ3  SJ  [SJ]
SJ4  SJ2W  [SJ_2]
SJ5  SJ  [SJ]
SJ6  SJ  [SJ]
SJ7  SJ  [SJ]
SJ8  SJ2W  [SJ_2]
SJ9  SJ  [SJ]
SJ10  SJ  [SJ]
SJ11  SJ  [SJ]
SJ12  SJ2W  [SJ_2]
SJ13  SJ  [SJ]
SJ14  SJ  [SJ]
SJ15  SJ  [SJ]
SJ16  SJ  [SJ]
U1  PCA9635PW  [SOP65P640X110-28N]
U2  PCA9635PW  [SOP65P640X110-28N]
U3  CD4051BM  [SOIC127P600X175-16N]
U4  PCA9635PW  [SOP65P640X110-28N]
U5  ULN2803ADWR  [SOIC127P1030X265-18N]
U6  ULN2803ADWR  [SOIC127P1030X265-18N]
U7  MCP3008-I/SL  [SOIC127P600X175-16N]
X1  2540-  [PAK100/2500-40]
X2  F09HP  [F09HP]
X3  MINI-USB-SCHIELD-32005-301  [32005-301]

## Nets
0/RXD: IC2.1(A:I0) IC4.30(PD0(RXD)) IC5.1(TXD)
1/TXD: IC2.4(B:I0) IC4.31(PD1(TXD)) IC5.5(RXD)
2: IC2.9(C:I0) IC4.32(PD2(INT0))
3: IC2.12(D:I0) IC4.1(PD3(INT1))
3,3V: C13.1 IC5.17(3V3OUT)
3.3V: C7.1 C8.1 IC1.9(VDD) R25.1 R26.1 R27.1 X1.17
4: IC3.1(A:I0) IC4.2(PD4(XCK/T0))
5: IC3.4(B:I0) IC4.9(PD5(T1))
6: IC3.9(C:I0) IC4.10(PD6(AIN0))
7: IC3.12(D:I0) IC4.11(PD7(AIN1))
8: IC4.12(PB0(ICP)) U3.11(A)
9: IC4.13(PB1(OC1A)) U3.10(B)
10: IC4.14(PB2(SS/OC1B)) U3.9(C)
11/MOSI: IC4.15(PB3(MOSI/OC2))
12/MISO: IC4.16(PB4(MISO))
13/SCK: IC4.17(PB5(SCK)) LED3.A
+3V3: C24.1 C25.1 C29.1 C30.1 C31.1 D14.3(C) D16.C IC7.8(VCC) JP1.1 Q1.3(G) Q2.3(G) R38.2 R39.2 R78.1 R80.2 R81.2 R82.2 R83.1 X1.1
+5V: C1.1 C2.1 C3.1 C4.1 C5.1 C6.1 C9.2 C10.1 C11.1 C12.1 C15.1 C16.1 C17.1 C20.1 C21.1 C22.1 C23.1 C26.1 C27.1 C28.1 D15.3(C) D17.C IC2.14(P:VCC) IC3.14(P:VCC) IC4.4(VCC) IC4.6(VCC) IC4.18(AVCC) IC5.4(VCCIO) IC5.20(VCC) IC6.4(P:V+) IC8.4(P:V+) JP1.3 R1.1 R2.1 R3.1 R4.1 R5.1 R6.1 R7.1 R8.1 R9.1 R10.1 R11.1 R12.1 R13.1 R14.1 R15.1 R16.1 R17.1 R18.1 R19.1 R20.1 R21.1 R22.1 R23.1 R24.1 R36.2 R37.2 R51.1 R52.1 R55.1 R56.1 U1.28(VDD) U2.28(VDD) U3.16(VDD) U4.28(VDD) X1.2 X1.4 X3.1
A: IC7.6(A) R83.2 X2.2
AD1: R40.2 U7.1(CH0)
AD2: R41.2 U7.2(CH1)
AD3: R42.2 U7.3(CH2)
AD4: R43.2 U7.4(CH3)
AD5: R44.2 U7.5(CH4)
AD6: R45.2 U7.6(CH5)
AD7: R46.2 U7.7(CH6)
AD8: R47.2 U7.8(CH7)
ADC0: IC4.23(PC0(ADC0)) U3.3(COM_OUT/IN)
ADC1: IC4.24(PC1(ADC1))
ADC2: IC4.25(PC2(ADC2))
ADC3: IC4.26(PC3(ADC3))
ADIN1: D5.3(C) PAD56.1(P) R40.1
ADIN2: D6.3(C) PAD57.1(P) R41.1
ADIN3: D7.3(C) PAD58.1(P) R42.1
ADIN4: D8.3(C) PAD59.1(P) R43.1
ADIN5: D9.3(C) PAD60.1(P) R44.1
ADIN6: D10.3(C) PAD61.1(P) R45.1
ADIN7: D11.3(C) PAD62.1(P) R46.1
ADIN8: D12.3(C) PAD63.1(P) R47.1
B: IC7.7(B) R84.2 X2.3
D+: IC5.15(USBDP) X3.3
D-: IC5.16(USBDM) X3.2
GND: C1.2 C2.2 C3.2 C4.2 C5.2 C6.2 C7.2 C8.2 C9.1 C10.2 C11.2 C12.2 C13.2 C15.2 C16.2 C17.2 C18.2 C19.2 C20.2 C21.2 C22.2 C23.2 C24.2 C25.2 C26.2 C27.2 C28.2 C29.2 C30.2 C31.2 D1.A D2.A D3.A D4.A D5.1(A) D6.1(A) D7.1(A) D8.1(A) D9.1(A) D10.1(A) D11.1(A) D12.1(A) D14.1(A) D15.1(A) D16.A D17.A IC1.10(VSS) IC2.7(P:GND) IC3.7(P:GND) IC4.3(GND) IC4.5(GND) IC4.20(AREF) IC4.21(GND) IC5.7(GND) IC5.11(!CTS) IC5.18(GND) IC5.21(GND) IC5.25(GND) IC5.26(TEST) IC6.11(P:V-) IC7.5(GND) IC8.11(P:V-) LED4.C LED5.C Q3.E Q4.2 Q5.E Q6.E Q7.E Q8.E Q9.E Q10.E Q11.E Q12.2(S) Q13.2(S) Q14.2(S) Q15.2(S) Q16.2(S) Q17.2(S) Q18.2(S) Q19.2(S) Q20.2(S) Q21.2(S) Q22.2(S) Q23.2(S) Q24.2(S) Q25.2(S) Q26.2(S) Q27.2(S) Q28.2(S) Q29.2(S) Q30.2(S) Q31.2(S) Q32.2(S) Q33.2(S) Q34.2(S) Q35.2(S) Q36.2(S) Q37.2(S) Q38.2(S) Q39.2(S) Q40.2(S) Q41.2(S) Q42.2(S) Q43.2(S) Q44.2(S) Q45.2(S) Q46.2(S) Q47.2(S) R28.1 R29.1 R30.1 R31.1 R48.2 R54.2 R57.2 R60.2 R63.2 R66.2 R69.2 R72.2 R75.2 R84.1 R86.2 R88.2 R90.2 R92.2 R94.2 R96.2 R98.2 R100.2 R102.2 R104.2 R106.2 R108.2 R110.2 R112.2 R114.2 R116.2 R118.2 R120.2 R122.2 R124.2 R126.2 R128.2 R130.2 R132.2 R134.2 R136.2 R138.2 R140.2 R142.2 R144.2 R146.2 R148.2 R150.2 S1.1(1.1) S1.2(1.2) SJ1.1 SJ2.1 SJ3.1 SJ4.3 SJ5.1 SJ6.1 SJ7.1 SJ8.3 SJ9.1 SJ10.1 SJ11.1 SJ12.3 SJ13.1 SJ14.1 SJ15.1 SJ16.1 U1.14(VSS) U2.14(VSS) U3.7(VSS) U3.8(VEE) U4.14(VSS) U5.9(GND) U6.5(5B) U6.6(6B) U6.7(7B) U6.8(8B) U6.9(GND) U7.9(DGND) U7.14(AGND) X1.6 X1.9 X1.14 X1.20 X1.25 X1.30 X1.34 X1.39 X3.5 X3.M1(S:S1) X3.M2(S:S2) X3.M3(S:S3) X3.M4(S:S4)
GPCLK0: X1.7
GPIO5: X1.29
GPIO6: X1.31
GPIO12: X1.32
GPIO13: X1.33
GPIO16: X1.36
GPIO17: X1.11
GPIO18: X1.12
GPIO19: X1.35
GPIO20: X1.38
GPIO21: X1.40
GPIO22: IC1.18(!RESET) X1.15
GPIO23: X1.16
GPIO24: IC1.20(INTA) X1.18
GPIO25: IC1.19(INTB) X1.22
GPIO26: X1.37
GPIO27: X1.13
HL1: IC2.2(A:I1) U1.6(LED0)
HL2: IC2.5(B:I1) U1.7(LED1)
HL3: IC2.10(C:I1) U1.8(LED2)
HL4: IC2.13(D:I1) U1.9(LED3)
HL5: IC3.2(A:I1) U1.10(LED4)
HL6: IC3.5(B:I1) U1.11(LED5)
HL7: IC3.10(C:I1) U1.12(LED6)
HL8: IC3.13(D:I1) U1.13(LED7)
ID_SC: X1.28
ID_SD: X1.27
INPUT1: D1.C IC1.8(GPB7) R28.2 R32.1
INPUT2: D2.C IC1.7(GPB6) R29.2 R33.1
INPUT3: D3.C IC1.6(GPB5) R30.2 R34.1
INPUT4: D4.C IC1.5(GPB4) R31.2 R35.1
INPUTK1: PAD76.1(P) R32.2
INPUTK2: PAD77.1(P) R33.2
INPUTK3: PAD78.1(P) R34.2
INPUTK4: PAD79.1(P) R35.2
N$1: IC1.28(GPA7) U5.8(8B)
N$2: IC1.27(GPA6) U5.7(7B)
N$3: IC1.26(GPA5) U5.6(6B)
N$4: IC1.25(GPA4) U5.5(5B)
N$5: IC1.24(GPA3) U5.4(4B)
N$6: IC1.23(GPA2) U5.3(3B)
N$7: IC1.22(GPA1) U5.2(2B)
N$8: IC1.21(GPA0) U5.1(1B)
N$9: R17.2 U4.1(A0)
N$10: R18.2 U4.2(A1)
N$11: R16.2 SJ8.1
N$12: R19.2 U4.3(A2)
N$13: R1.2 U1.1(A0)
N$14: R2.2 U1.2(A1)
N$15: R3.2 U1.3(A2)
N$16: R4.2 U1.4(A3)
N$17: R7.2 SJ1.2 U1.25(A6)
N$18: R6.2 SJ2.2 U1.24(A5)
N$19: R5.2 SJ3.2 U1.5(A4)
N$20: R8.2 SJ4.1
N$21: R20.2 U4.4(A3)
N$22: R9.2 U2.1(A0)
N$23: R10.2 U2.2(A1)
N$24: R11.2 U2.3(A2)
N$25: R12.2 U2.4(A3)
N$26: R13.2 SJ5.2 U2.5(A4)
N$27: R14.2 SJ6.2 U2.24(A5)
N$28: R15.2 SJ7.2 U2.25(A6)
N$29: R21.2 SJ11.2 U4.5(A4)
N$30: R22.2 SJ10.2 U4.24(A5)
N$31: R23.2 SJ9.2 U4.25(A6)
N$32: Q45.3(G) R145.1 R146.1
N$33: IC1.1(GPB0) U6.1(1B)
N$34: IC1.2(GPB1) U6.2(2B)
N$35: IC1.3(GPB2) U6.3(3B)
N$36: R24.2 SJ12.1
N$37: IC6.2(A:-IN) R152.1 R153.2
N$38: IC1.15(A0) R25.2 SJ15.2
N$39: IC1.16(A1) R26.2 SJ13.2
N$40: IC1.17(A2) R27.2 SJ14.2
N$41: IC1.4(GPB3) U6.4(4B)
N$42: PAD64.1(P) U5.18(1C)
N$43: PAD65.1(P) U5.17(2C)
N$44: PAD66.1(P) U5.16(3C)
N$45: PAD67.1(P) U5.15(4C)
N$46: PAD68.1(P) U5.14(5C)
N$47: PAD69.1(P) U5.13(6C)
N$48: PAD70.1(P) U5.12(7C)
N$49: PAD71.1(P) U5.11(8C)
N$50: PAD72.1(P) U6.18(1C)
N$51: PAD73.1(P) U6.17(2C)
N$52: PAD74.1(P) U6.16(3C)
N$53: PAD75.1(P) U6.15(4C)
N$54: IC2.3(A:O) Q3.B R48.1
N$55: IC4.8(PB7(XTAL2/TOSC2)) Q4.3
N$56: Q3.C R49.2
N$57: R49.1 R50.2
N$58: PAD48.1(P) R50.1
N$59: IC4.7(PB6(XTAL1/TOSC1)) Q4.1
N$60: C14.1 IC5.2(!DTR)
N$61: LED1.A R51.2
N$62: LED2.A R52.2
N$64: LED3.C R54.1
N$65: R56.2 SJ16.2 U3.6(INH)
N$66: IC2.6(B:O) Q5.B R57.1
N$67: Q5.C R58.2
N$68: R58.1 R59.2
N$69: PAD49.1(P) R59.1
N$70: IC2.8(C:O) Q6.B R60.1
N$71: Q6.C R61.2
N$72: R61.1 R62.2
N$73: PAD50.1(P) R62.1
N$74: IC2.11(D:O) Q7.B R63.1
N$75: Q7.C R64.2
N$76: R64.1 R65.2
N$77: PAD51.1(P) R65.1
N$78: IC3.3(A:O) Q8.B R66.1
N$79: Q8.C R67.2
N$80: R67.1 R68.2
N$81: PAD52.1(P) R68.1
N$82: IC3.6(B:O) Q9.B R69.1
N$83: Q9.C R70.2
N$84: R70.1 R71.2
N$85: PAD53.1(P) R71.1
N$86: IC3.8(C:O) Q10.B R72.1
N$87: Q10.C R73.2
N$88: R73.1 R74.2
N$89: PAD54.1(P) R74.1
N$90: IC3.11(D:O) Q11.B R75.1
N$91: Q11.C R76.2
N$92: R76.1 R77.2
N$93: PAD55.1(P) R77.1
N$94: Q15.3(G) R85.1 R86.1
N$95: C18.1 C19.1 R78.2 U7.15(VREF) U7.16(VDD)
N$96: PAD1.1(P) Q45.1(D)
N$97: X2.5
N$98: Q12.3(G) R79.2
N$99: PAD31.1(P) Q15.1(D)
N$100: IC7.2(RE/) IC7.3(DE) Q12.1(D) R80.1
N$101: Q16.3(G) R87.1 R88.1
N$102: Q46.3(G) R147.1 R148.1
N$103: LED4.A Q13.1(D) R81.1
N$104: LED5.A Q14.1(D) R82.1
N$105: PAD32.1(P) Q16.1(D)
N$106: IC6.3(A:+IN) R53.2 R151.1
N$107: Q17.3(G) R89.1 R90.1
N$108: PAD2.1(P) Q46.1(D)
N$109: PAD33.1(P) Q17.1(D)
N$110: Q18.3(G) R91.1 R92.1
N$111: Q47.3(G) R149.1 R150.1
N$112: PAD34.1(P) Q18.1(D)
N$113: Q19.3(G) R93.1 R94.1
N$114: PAD3.1(P) Q47.1(D)
N$115: PAD35.1(P) Q19.1(D)
N$116: Q20.3(G) R95.1 R96.1
N$117: IC6.5(B:+IN) R154.2 R155.1
N$118: PAD36.1(P) Q20.1(D)
N$119: Q21.3(G) R97.1 R98.1
N$120: IC6.6(B:-IN) R156.2 R157.1
N$121: PAD37.1(P) Q21.1(D)
N$122: Q22.3(G) R99.1 R100.1
N$124: PAD80.1(P) Q22.1(D)
N$125: Q23.3(G) R101.1 R102.1
N$126: IC6.10(C:+IN) R158.2 R159.1
N$127: PAD81.1(P) Q23.1(D)
N$128: Q24.3(G) R103.1 R104.1
N$129: IC6.9(C:-IN) R160.2 R161.1
N$130: PAD82.1(P) Q24.1(D)
N$131: Q25.3(G) R105.1 R106.1
N$133: PAD83.1(P) Q25.1(D)
N$134: Q26.3(G) R107.1 R108.1
N$135: IC6.12(D:+IN) R162.2 R163.1
N$136: PAD84.1(P) Q26.1(D)
N$137: Q27.3(G) R109.1 R110.1
N$138: IC6.13(D:-IN) R164.2 R165.1
N$139: PAD85.1(P) Q27.1(D)
N$140: Q28.3(G) R111.1 R112.1
N$142: PAD86.1(P) Q28.1(D)
N$143: Q29.3(G) R113.1 R114.1
N$144: IC8.3(A:+IN) R166.2 R167.1
N$145: PAD87.1(P) Q29.1(D)
N$146: Q30.3(G) R115.1 R116.1
N$147: IC8.2(A:-IN) R168.2 R170.1
N$148: PAD88.1(P) Q30.1(D)
N$149: Q31.3(G) R117.1 R118.1
N$151: PAD89.1(P) Q31.1(D)
N$152: Q32.3(G) R119.1 R120.1
N$153: IC8.5(B:+IN) R169.2 R171.1
N$154: PAD90.1(P) Q32.1(D)
N$155: Q33.3(G) R121.1 R122.1
N$156: IC8.6(B:-IN) R172.2 R173.1
N$157: PAD91.1(P) Q33.1(D)
N$158: Q34.3(G) R123.1 R124.1
N$159: IC8.10(C:+IN) R174.2 R175.1
N$160: PAD92.1(P) Q34.1(D)
N$161: Q35.3(G) R125.1 R126.1
N$162: IC8.9(C:-IN) R176.2 R177.1
N$163: PAD93.1(P) Q35.1(D)
N$164: Q36.3(G) R127.1 R128.1
N$166: PAD94.1(P) Q36.1(D)
N$167: Q37.3(G) R129.1 R130.1
N$168: IC8.12(D:+IN) R178.2 R179.1
N$169: PAD95.1(P) Q37.1(D)
N$170: Q38.3(G) R131.1 R132.1
N$171: IC8.13(D:-IN) R180.2 R181.1
N$172: PAD96.1(P) Q38.1(D)
N$173: Q39.3(G) R133.1 R134.1
N$175: PAD97.1(P) Q39.1(D)
N$176: Q40.3(G) R135.1 R136.1
N$178: PAD98.1(P) Q40.1(D)
N$179: Q41.3(G) R137.1 R138.1
N$181: PAD99.1(P) Q41.1(D)
N$182: Q42.3(G) R139.1 R140.1
N$184: PAD100.1(P) Q42.1(D)
N$185: Q43.3(G) R141.1 R142.1
N$187: PAD101.1(P) Q43.1(D)
N$188: Q44.3(G) R143.1 R144.1
N$190: PAD102.1(P) Q44.1(D)
OE1: SJ4.2 U1.23(~OE)
OE2: SJ8.2 U2.23(~OE)
OE3: SJ12.2 U4.23(~OE)
OFFEN1: PAD42.1(P) U1.18(LED11)
OFFEN2: PAD43.1(P) U1.19(LED12)
OFFEN3: PAD44.1(P) U1.20(LED13)
OFFEN4: PAD45.1(P) U1.21(LED14)
OFFEN5: PAD46.1(P) U1.22(LED15)
REF: JP1.2 R151.2 R155.2 R159.2 R163.2 R167.2 R171.2 R175.2 R179.2
RESET: C14.2 IC4.29(PC6(/RESET)) R55.2 S1.3(2.1) S1.4(2.2)
RGB1.1: R133.2 U2.21(LED14)
RGB1.2: R135.2 U2.20(LED13)
RGB1.3: R137.2 U2.19(LED12)
RGB2.1: R139.2 U2.18(LED11)
RGB2.2: R141.2 U2.17(LED10)
RGB2.3: R143.2 U2.16(LED9)
RGB3.1: R121.2 U2.15(LED8)
RGB3.2: R123.2 U2.13(LED7)
RGB3.3: R125.2 U2.12(LED6)
RGB4.1: R127.2 U2.11(LED5)
RGB4.2: R129.2 U2.10(LED4)
RGB4.3: R131.2 U2.9(LED3)
RGB5.1: R109.2 U2.8(LED2)
RGB5.2: R111.2 U2.7(LED1)
RGB5.3: R113.2 U2.6(LED0)
RGB6.1: R115.2 U4.21(LED14)
RGB6.2: R117.2 U4.20(LED13)
RGB6.3: R119.2 U4.19(LED12)
RGB7.1: R97.2 U4.18(LED11)
RGB7.2: R99.2 U4.17(LED10)
RGB7.3: R101.2 U4.16(LED9)
RGB8.1: R103.2 U4.15(LED8)
RGB8.2: R105.2 U4.13(LED7)
RGB8.3: R107.2 U4.12(LED6)
RGB9.1: R85.2 U4.11(LED5)
RGB9.2: R87.2 U4.10(LED4)
RGB9.3: R89.2 U4.9(LED3)
RGB10.1: R91.2 U4.8(LED2)
RGB10.2: R93.2 U4.7(LED1)
RGB10.3: R95.2 U4.6(LED0)
RXLED: IC5.22(CBUS1) LED2.C
SCL: IC1.12(SCL) IC4.28(PC5(ADC5/SCL)) Q2.1(D) R36.1 U1.26(SCL) U2.26(SCL) U4.26(SCL)
SCL_PI: Q2.2(S) R38.1 X1.5
SDA: IC1.13(SDA) IC4.27(PC4(ADC4/SDA)) Q1.1(D) R37.1 U1.27(SDA) U2.27(SDA) U4.27(SDA)
SDA_PI: Q1.2(S) R39.1 X1.3
SHUNT_IN_1: IC6.1(A:OUT) R152.2 U3.13
SHUNT_IN_1_+: PAD4.1(P) R53.1
SHUNT_IN_1_-: PAD5.1(P) R153.1
SHUNT_IN_2: IC6.7(B:OUT) R157.2 U3.14
SHUNT_IN_2_+: PAD6.1(P) R154.1
SHUNT_IN_2_-: PAD7.1(P) R156.1
SHUNT_IN_3: IC6.8(C:OUT) R161.2 U3.15
SHUNT_IN_3_+: PAD8.1(P) R158.1
SHUNT_IN_3_-: PAD9.1(P) R160.1
SHUNT_IN_4: IC6.14(D:OUT) R165.2 U3.12
SHUNT_IN_4+: PAD10.1(P) R162.1
SHUNT_IN_4_-: PAD11.1(P) R164.1
SHUNT_IN_5: IC8.1(A:OUT) R170.2 U3.1
SHUNT_IN_5_+: PAD12.1(P) R166.1
SHUNT_IN_5_-: PAD13.1(P) R168.1
SHUNT_IN_6: IC8.7(B:OUT) R173.2 U3.5
SHUNT_IN_6_+: PAD14.1(P) R169.1
SHUNT_IN_6_-: PAD15.1(P) R172.1
SHUNT_IN_7: IC8.8(C:OUT) R177.2 U3.2
SHUNT_IN_7_+: PAD16.1(P) R174.1
SHUNT_IN_7_-: PAD17.1(P) R176.1
SHUNT_IN_8: IC8.14(D:OUT) R181.2 U3.4
SHUNT_IN_8_+: PAD18.1(P) R178.1
SHUNT_IN_8_-: PAD19.1(P) R180.1
SPI_CE0: U7.10(*CS/SHDN) X1.24
SPI_CE1: X1.26
SPI_MISO: U7.12(DOUT) X1.21
SPI_MOSI: U7.11(DIN) X1.19
SPI_SCLK: U7.13(CLK) X1.23
TEKRGB1.1: R145.2 U1.15(LED8)
TEKRGB1.2: R147.2 U1.16(LED9)
TEKRGB1.3: R149.2 U1.17(LED10)
TXLED: IC5.23(CBUS0) LED1.C
UART_RXD: IC7.1(RO) Q13.3(G) X1.10
UART_TXD: IC7.4(DI) Q14.3(G) R79.1 X1.8
Unconnected: IC4.19(ADC6) IC4.22(ADC7) IC5.3(!RTS) IC5.6(!RI) IC5.9(!DSR) IC5.10(!DCD) IC5.12(CBUS4) IC5.13(CBUS2) IC5.14(CBUS3) IC5.19(!RESET) IC5.27(OSCI) IC5.28(OSCO) S1.5(SH) U2.22(LED15) U4.22(LED15) U5.10(COM) U6.10(COM) U6.11(8C) U6.12(7C) U6.13(6C) U6.14(5C) X2.1 X2.4 X2.6 X2.7 X2.8 X2.9 X3.4

## Notes on the sheet
- Main Licht
- RGB2
- RGB1

## Library data of the parts
C1-C8 C11-C13 C15-C31 = rcl:C-EU: CAPACITOR, European symbol
C9 C10 C14 = resistor:C-EU: CAPACITOR, European symbol
D1-D4 D16 D17 = diode:ZENER-DIODE: Z-Diode
D5-D12 D14 D15 = diode:BAT54: Schottky Diodes Source: Fairchild .. BAT54.pdf
IC1 = microchip:MCP23017: http://ww1.microchip.com/downloads/en/DeviceDoc/21952a.pdf Source: http://ww1.microchip.com/downloads/en/DeviceDoc/21952a.pdf; MF: MICROCHIP; MPN: MCP23017-E/SO; OC_FARNELL: 1332087; OC_NEWARK: 31K2958
IC2 IC3 = 74xx-eu:74*08: Quad 2-input AND gate
IC4 = atmel:MEGA8: MICROCONTROLLER 8 Kbytes FLASH, 1 kbytes SRAM, 512 bytes EEPROM, USART, 6-channel 10 bit ADC, 2-channel 8 bit ADC Pin compatible with Atmega48, ATMega88, ATMega168 Source: avr.lbr; MPN: ATMEGA8-16AU; OC_FARNELL: 9171371; OC_NEWARK: 73M8863
IC5 = ftdichip:FT232R: Source: http://www.ftdichip.com/Documents/DataSheets/DS_FT232R_v104.pdf; MPN: FT232RL; OC_FARNELL: 1146032; OC_NEWARK: 91K9918
IC6 IC8 = linear:LM324: OP AMP
IC7 = maxim:MAX481CSA: RS485 TRANSEIVER; MF: MAXIM; MPN: MAX481CSA; OC_FARNELL: unknown; OC_NEWARK: 90C3817
JP1 = jumper:JP2E: JUMPER
LED1-LED5 = led:LED: LED OSRAM: - CHIPLED LG R971, LG N971, LY N971, LG Q971, LY Q971, LO R971, LY R971 LH N974, LH R974 LS Q976, LO Q976, LY Q976 LO Q996 - Hyper CHIPLED LW Q18S LB Q993, LB Q99A, LB R99A - SideLED LS A670, LO A670, LY A670, LG A670, LP A670 LB A673, LV A673, LT A673, LW A673 LH A674 LY A675 LS A676, LA A676, LO A676, LY A676, LW A676 LS A679, LY A679, LG A679 - Hyper Micro SIDELED® LS Y876, LA Y876, LO Y876, LY Y876 LT Y87S - SmartLED LW L88C, LW L88S LB L89C, LB L89S, LG L890 LS L89K, LO L89K, LY L89K LS L896, LA L896, LO L896, LY L896 - TOPLED LS T670, LO T670, LY T670, LG T670, LP T670 LSG T670, LSP T670, LSY T670, LOP T670, LYG T670 LG T671, LOG T671, LSG T671 LB T673, LV T673, LT T673, LW T673 LH T674 LS T676, LA T676, LO T676, LY T676, LB T676, LH T676, LSB T676, LW T676 LB T67C, LV T67C, LT T67C, LS T67K, LO T67K, LY T67K, LW E67C LS E67B, LA E67B, LO E67B, LY E67B, LB E67C, LV E67C, LT E67C LW T67C LS T679, LY T679, LG T679 LS T770, LO T770, LY T770, LG T770, LP T770 LB T773, LV T773, LT T773, LW T773 LH T774 LS E675, LA E675, LY E675, LS T675 LS T776, LA T776, LO T776, LY T776, LB T776 LHGB T686 LT T68C, LB T68C - Hyper Mini TOPLED® LB M676 - Mini TOPLED Santana® LG M470 LS M47K, LO M47K, LY M47K Source: http://www.osram.convergy.de LUXEON: - LUMILED® LXK2-PW12-R00, LXK2-PW12-S00, LXK2-PW14-U00, LXK2-PW14-V00 LXK2-PM12-R00, LXK2-PM12-S00, LXK2-PM14-U00 LXK2-PE12-Q00, LXK2-PE12-R00, LXK2-PE12-S00, LXK2-PE14-T00, LXK2-PE14-U00 LXK2-PB12-K00, LXK2-PB12-L00, LXK2-PB12-M00, LXK2-PB14-N00, LXK2-PB14-P00, LXK2-PB14-Q00 LXK2-PR12-L00, LXK2-PR12-M00, LXK2-PR14-Q00, LXK2-PR14-R00 LXK2-PD12-Q00, LXK2-PD12-R00, LXK2-PD12-S00 LXK2-PH12-R00, LXK2-PH12-S00 LXK2-PL12-P00, LXK2-PL12-Q00, LXK2-PL12-R00 Source: www.luxeon.com KINGBRIGHT: KA-3528ASYC Source: www.kingbright.com
PAD1-PAD19 PAD31-PAD37 PAD42-PAD46 PAD48-PAD63 PAD80-PAD102 = wirepad:WIREPAD: Wire PAD connect wire on PCB
PAD64-PAD79 = wirepad:3,81/1,4: THROUGH-HOLE PAD
Q1 Q2 Q12-Q47 = transistor-small-signal:MMBFJ3*: N-Channel RF Amplifier Source: http://www.fairchildsemi.com/pf/J3/J310.html
Q3 Q5-Q11 = transistor-npn:BC817*: NPN Transistor
Q4 = murata-filter:CSTCR: Resonator Source: murata.co.jp; MPN: CSTCR6M00G53-R0; OC_FARNELL: 1170434; OC_NEWARK: 25M8759
R1-R181 = resistor:R-EU_: RESISTOR, European symbol
S1 = switch:SKHMP*E010: 6.2 X 6.5mm TACT Switch (SMD) Source: http://www3.alps.co.jp/WebObjects/catalog.woa/PDF/E/Switch/Tact/SKHM/SKHM.PDF
SJ1-SJ3 SJ5-SJ7 SJ9-SJ11 SJ13-SJ16 = jumper:SJ: SMD solder JUMPER
SJ4 SJ8 SJ12 = jumper:SJ2W: SMD solder JUMPER
U1 U2 U4 = pca9635:PCA9635PW: 16-bit Fm+ I2C-bus LED driver; MPN: PCA9635PW; OC_FARNELL: 1854073; OC_NEWARK: 30T3006; PACKAGE: TSSOP-28; SUPPLIER: NXP
U3 = CD4051:CD4051BM: CMOS Analog Multiplexers/Demultiplexers with Logic Level Conversion; MPN: CD4051BM; OC_FARNELL: 8388970; OC_NEWARK: 05B5595; PACKAGE: SOIC-16; SUPPLIER: Texas Instruments
U5 U6 = uln2803:ULN2803ADWR: Darlington transistor array; MPN: ULN2803ADWR; OC_FARNELL: 1652420; OC_NEWARK: 87H4769; PACKAGE: SOIC-18; SUPPLIER: TEXAS INSTRUMENTS
U7 = MCP3008:MCP3008-I/SL: 10BIT ADC, 8 CH, SPI, SMD; MPN: MCP3008-I/SL; OC_FARNELL: 1292241; OC_NEWARK: 19C7201; PACKAGE: SOIC16; SUPPLIER: Microchip
X1 = con-3m:2540-: 3M (TM) Pak 100 4-Wall Header Source: 3M; OC_FARNELL: unknown; OC_NEWARK: unknown
X2 = con-subd:F09: SUB-D; OC_FARNELL: unknown; OC_NEWARK: unknown
X3 = con-cypressindustries:MINI-USB-SCHIELD-: MINI USB-B Conector Source: www.cypressindustries.com; OC_FARNELL: unknown; OC_NEWARK: unknown